# Altium project 分拣小车.PrjPcb
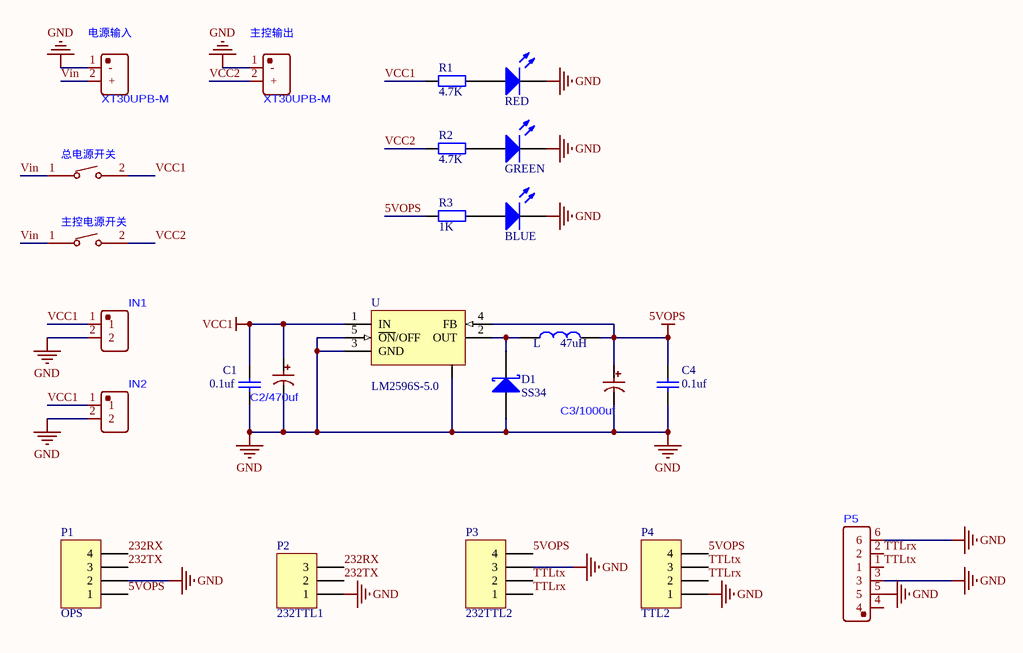
[diagram p0: 分拣小车.SchDoc]
1 sheet, 24 parts. Net scope: global (net labels, ports and power ports of the same name join across sheets).
Board file: 分拣.PcbDoc

## Sheet 分拣小车.SchDoc
size A4

### Parts
BLUE  LED0  [LED_0805]  (value not drawn)
C1  value 0.1uf  [C-RAD-0603]  (hidden comment: Cap)
C2/470uf  (no value)  [CAP-SMD_BD10.0-L10.3-W10.3-FD]
C3/1000uf  (no value)  [CAP-SMD_BD10.0-L10.3-W10.3-FD]
C4  value 0.1uf  [C-RAD-0603]  (hidden comment: Cap)
D1  Type: SS34  [DIODE-SMA]  (hidden comment: D-Schottky)
GREEN  LED0  [LED_0805]  (value not drawn)
IN1  (no value)  [CONN-TH_P5.00_KF301-5.0-2P]
IN2  (no value)  [CONN-TH_P5.00_KF301-5.0-2P]
L  47uH  [L1010]
P1  OPS  [HDR1X4]
P2  232TTL1  [HDR1X3]
P3  232TTL2  [HDR1X4]
P4  TTL2  [HDR1X4]
P5  (no value)  [CONN-SMD_4P-P1.25_GH1.254P]
R1  value 4.7K  [0805-2]  (hidden comment: Res1)
R2  value 4.7K  [0805-2]  (hidden comment: Res1)
R3  value 1K  [0805-2]  (hidden comment: Res1)
RED  LED0  [LED_0805]  (value not drawn)
U  LM2596S-5.0  [TO-263-5]
主控电源开关  (no value)  [SW-TH_R1966ABLKBLKFF]
主控输出  XT30UPB-M  [CONN-TH_XT30UPB-M]
总电源开关  (no value)  [SW-TH_R1966ABLKBLKFF]
电源输入  XT30UPB-M  [CONN-TH_XT30UPB-M]

### Nets
5VOPS: C3/1000uf.1 C4.2 L.2 P1.1 P3.4 P4.4 R3.1 U.4(FB)
GND: BLUE.2(K) C1.1 C2/470uf.2 C3/1000uf.2 C4.1 D1.1(A) GREEN.2(K) IN1.2 IN2.2 P1.2 P2.1 P3.3 P4.1 P5.3 P5.5 P5.6 RED.2(K) U.3(GND) U.5(~{ON}/OFF) U.6 主控输出.1(-) 电源输入.1(-)
VCC1: C1.2 C2/470uf.1 IN1.1 IN2.1 R1.1 U.1(IN) 总电源开关.2
232RX: P1.4 P2.3
232TX: P1.3 P2.2
TTLrx: P3.1 P4.2 P5.2
TTLtx: P3.2 P4.3 P5.1
VCC2: R2.1 主控电源开关.2 主控输出.2(+)
Vin: 主控电源开关.1 总电源开关.1 电源输入.2(+)
NetBLUE_1: BLUE.1(A) R3.2
NetD1_2: D1.2(K) L.1 U.2(OUT)
NetGREEN_1: GREEN.1(A) R2.2
NetR1_2: R1.2 RED.1(A)

Not connected (* = marked no-connect by the designer): P5 4

### Library data of the parts
BLUE GREEN RED = LED0: 发光二极管; Published: 8-Jun-2000; LatestRevisionDate: 08-Jul-2005; LatestRevisionNote: Mech Layer 1 removed.; PackageReference: LED-0; Publisher: Altium Limited
C1 C4 = Cap: 无极性电容; Published: 8-Jun-2000; LatestRevisionDate: 17-Jul-2002; LatestRevisionNote: Re-released for DXP Platform.; PackageReference: RAD-0.3; Publisher: Altium Limited
C2/470uf C3/1000uf = RVT1J101M1010
D1 = D-Schottky: 肖特基二极管; Published: 8-Jun-2000; LatestRevisionDate: 17-Jul-2002; LatestRevisionNote: Re-released for DXP Platform.; PackageReference: SMB; Publisher: Altium Limited; Code_JEDEC: DO-214-AA
IN1 IN2 = KF301-5.0-2P
L = L
P1 P3 P4 = Header 4: Header, 4-Pin; LatestRevisionDate: 17-Jul-2002; LatestRevisionNote: Re-released for DXP Platform.; Publisher: Altium Limited
P2 = Header 3: Header, 3-Pin; LatestRevisionDate: 17-Jul-2002; LatestRevisionNote: Re-released for DXP Platform.; Publisher: Altium Limited
P5 = GH1.254P立贴
R1-R3 = Res1: 贴片电阻; Published: 8-Jun-2000; LatestRevisionDate: 17-Jul-2002; LatestRevisionNote: Re-released for DXP Platform.; PackageReference: AXIAL-0.4; Publisher: Altium Limited
U = LM2596S-5.0: 5V稳压芯片; Note: Tab is connected to GND; Published: 15-Apr-2002; DatasheetVersion: Dec-1997; PackageReference: TS5B; Publisher: Altium Limited; PackageDescription: D2-PAK; 5 Leads; Body 14.4 (inc. leads) x 10.4 mm (LxW max); ComponentLink1Description: Manufacturer Link; ComponentLink1URL: http://www.national.com/; ComponentLink2Description: Datasheet; ComponentLink2URL: http://www.national.com/ds.cgi/LM/LM2596.pdf; ComponentLink3Description: URL Link1; ComponentLink3URL: http://www.national.com/pf/LM/LM2596.html
主控电源开关 总电源开关 = KCD1-101船型开关黑色